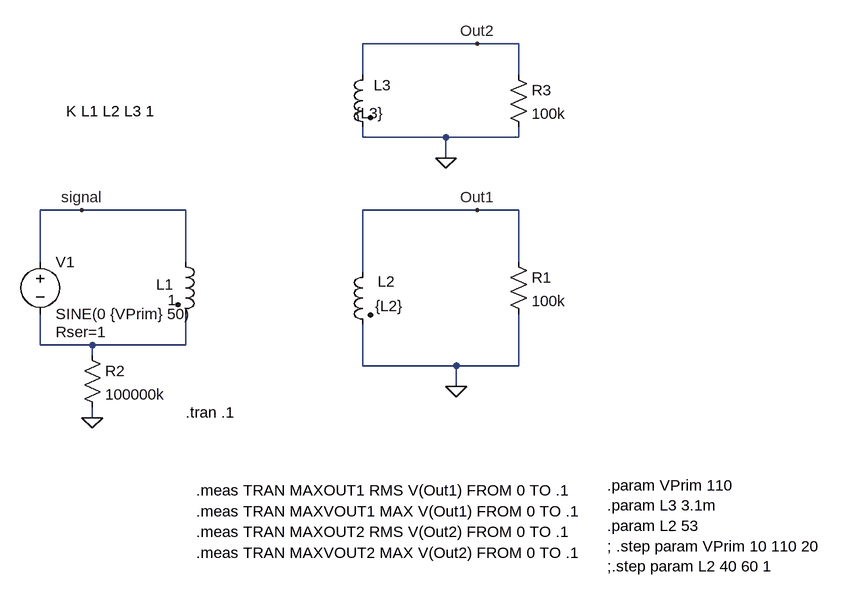
[diagram p0: schematic Transform2.asc]
Transform2.asc, the LTspice schematic file:
Version 4
SHEET 1 1360 680
WIRE 544 -256 368 -256
WIRE 608 -256 544 -256
WIRE 368 -208 368 -256
WIRE 608 -208 608 -256
WIRE 368 -112 368 -128
WIRE 496 -112 368 -112
WIRE 608 -112 608 -128
WIRE 608 -112 496 -112
WIRE 496 -80 496 -112
WIRE -64 0 -128 0
WIRE 96 0 -64 0
WIRE 544 0 368 0
WIRE 608 0 544 0
WIRE -128 80 -128 0
WIRE 96 80 96 0
WIRE 608 80 608 0
WIRE 368 96 368 0
WIRE -128 208 -128 160
WIRE -48 208 -128 208
WIRE 96 208 96 160
WIRE 96 208 -48 208
WIRE -48 224 -48 208
WIRE 368 240 368 176
WIRE 512 240 368 240
WIRE 608 240 608 160
WIRE 608 240 512 240
WIRE 512 272 512 240
WIRE -48 320 -48 304
FLAG 512 272 0
FLAG -48 320 0
FLAG -64 0 signal
FLAG 544 0 Out1
FLAG 544 -256 Out2
FLAG 496 -80 0
SYMBOL ind2 80 64 R0
WINDOW 0 -30 51 Left 2
WINDOW 3 -12 75 Left 2
SYMATTR InstName L1
SYMATTR Value 1
SYMATTR Type ind
SYMBOL ind2 384 80 M0
WINDOW 0 -34 30 Left 2
WINDOW 3 -47 68 Left 2
SYMATTR InstName L2
SYMATTR Value {L2}
SYMATTR Type ind
SYMBOL voltage -128 64 R0
WINDOW 123 0 0 Left 0
WINDOW 39 24 124 Left 2
SYMATTR SpiceLine Rser=1
SYMATTR InstName V1
SYMATTR Value SINE(0 {VPrim} 50)
SYMBOL res 592 64 R0
SYMATTR InstName R1
SYMATTR Value 100k
SYMBOL res -64 208 R0
SYMATTR InstName R2
SYMATTR Value 100000k
SYMBOL ind2 384 -224 M0
WINDOW 0 -28 32 Left 2
WINDOW 3 -17 75 Left 2
SYMATTR InstName L3
SYMATTR Value {L3}
SYMATTR Type ind
SYMBOL res 592 -224 R0
SYMATTR InstName R3
SYMATTR Value 100k
TEXT -88 -152 Left 2 !K L1 L2 L3 1
TEXT 96 312 Left 2 !.tran .1
TEXT 112 496 Left 2 !.meas TRAN MAXOUT2 RMS V(Out2) FROM 0 TO .1
TEXT 112 432 Left 2 !.meas TRAN MAXOUT1 RMS V(Out1) FROM 0 TO .1
TEXT 744 424 Left 2 !.param VPrim 110\n.param L3 3.1m\n.param L2 53\n; .step param VPrim 10 110 20\n;.step param L2 40 60 1
TEXT 112 464 Left 2 !.meas TRAN MAXVOUT1 MAX V(Out1) FROM 0 TO .1
TEXT 112 528 Left 2 !.meas TRAN MAXVOUT2 MAX V(Out2) FROM 0 TO .1

The netlist it stands for:
* Transform2.asc
L1 signal N001 1
L2 Out1 0 {L2}
V1 signal N001 SINE(0 {VPrim} 50) Rser=1
R1 Out1 0 100k
R2 N001 0 100000k
L3 Out2 0 {L3}
R3 Out2 0 100k
K L1 L2 L3 1
.tran .1
.meas TRAN MAXOUT2 RMS V(Out2) FROM 0 TO .1
.meas TRAN MAXOUT1 RMS V(Out1) FROM 0 TO .1
.param VPrim 110
.param L3 3.1m
.param L2 53
; .step param VPrim 10 110 20
;.step param L2 40 60 1
.meas TRAN MAXVOUT1 MAX V(Out1) FROM 0 TO .1
.meas TRAN MAXVOUT2 MAX V(Out2) FROM 0 TO .1
.backanno
.end